# Altium schematic sheet FPGA ram.SchDoc
size A4; Organization: Blinkinlabs, LLC
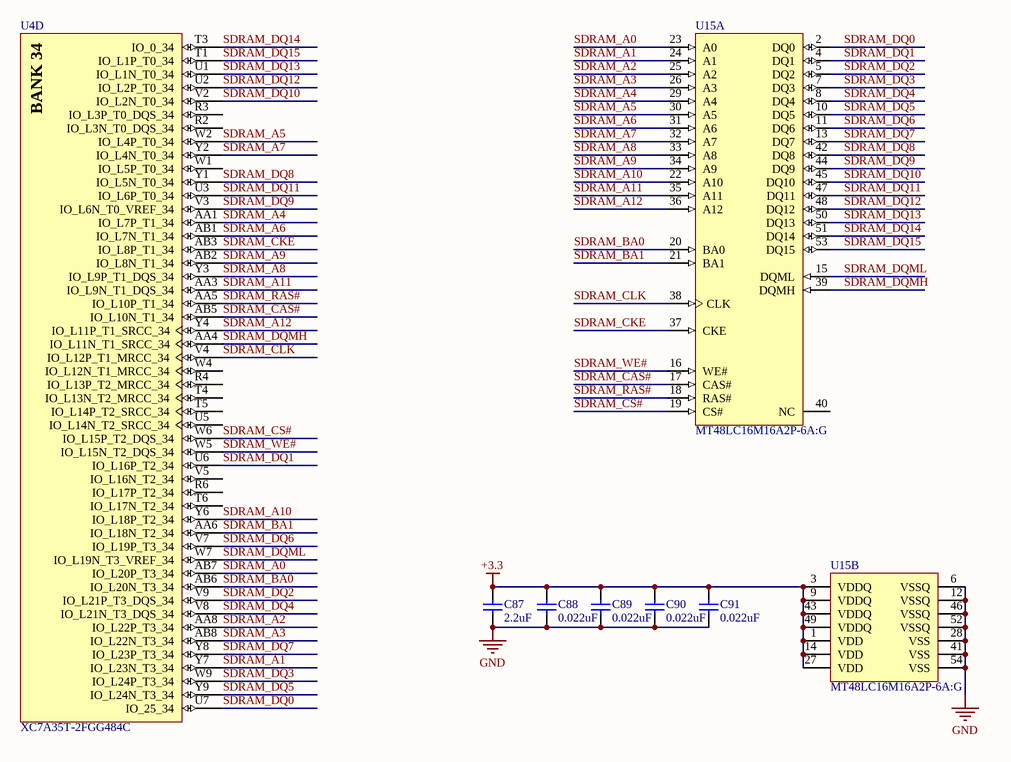
[diagram p0: FPGA ram.SchDoc]

## Parts
C87  2.2uF  [CAPC1005X06L]
C88  0.022uF  [CAPC1005X06L]
C89  0.022uF  [CAPC1005X06L]
C90  0.022uF  [CAPC1005X06L]
C91  0.022uF  [CAPC1005X06L]
U4  XC7A35T-2FGG484C  [FGG484]  (part D of 12)
U15  MT48LC16M16A2P-6A:G  [MICT-TG-54_M]  (parts A,B of 2)

## Nets
+3.3: C87.1 C88.1 C89.1 C90.1 C91.1 U15.1(VDD) U15.3(VDDQ) U15.9(VDDQ) U15.14(VDD) U15.27(VDD) U15.43(VDDQ) U15.49(VDDQ)
GND: C87.2 C88.2 C89.2 C90.2 C91.2 U15.6(VSSQ) U15.12(VSSQ) U15.28(VSS) U15.41(VSS) U15.46(VSSQ) U15.52(VSSQ) U15.54(VSS)
SDRAM_A0: U4.AB7(IO_L20P_T3_34) U15.23(A0)
SDRAM_A1: U4.Y7(IO_L23N_T3_34) U15.24(A1)
SDRAM_A2: U4.AA8(IO_L22P_T3_34) U15.25(A2)
SDRAM_A3: U4.AB8(IO_L22N_T3_34) U15.26(A3)
SDRAM_A4: U4.AA1(IO_L7P_T1_34) U15.29(A4)
SDRAM_A5: U4.W2(IO_L4P_T0_34) U15.30(A5)
SDRAM_A6: U4.AB1(IO_L7N_T1_34) U15.31(A6)
SDRAM_A7: U4.Y2(IO_L4N_T0_34) U15.32(A7)
SDRAM_A8: U4.Y3(IO_L9P_T1_DQS_34) U15.33(A8)
SDRAM_A9: U4.AB2(IO_L8N_T1_34) U15.34(A9)
SDRAM_A10: U4.Y6(IO_L18P_T2_34) U15.22(A10)
SDRAM_A11: U4.AA3(IO_L9N_T1_DQS_34) U15.35(A11)
SDRAM_A12: U4.Y4(IO_L11P_T1_SRCC_34) U15.36(A12)
SDRAM_BA0: U4.AB6(IO_L20N_T3_34) U15.20(BA0)
SDRAM_BA1: U4.AA6(IO_L18N_T2_34) U15.21(BA1)
SDRAM_CAS#: U4.AB5(IO_L10N_T1_34) U15.17(CAS#)
SDRAM_CKE: U4.AB3(IO_L8P_T1_34) U15.37(CKE)
SDRAM_CLK: U4.V4(IO_L12P_T1_MRCC_34) U15.38(CLK)
SDRAM_CS#: U4.W6(IO_L15P_T2_DQS_34) U15.19(CS#)
SDRAM_DQ0: U4.U7(IO_25_34) U15.2(DQ0)
SDRAM_DQ1: U4.U6(IO_L16P_T2_34) U15.4(DQ1)
SDRAM_DQ2: U4.V9(IO_L21P_T3_DQS_34) U15.5(DQ2)
SDRAM_DQ3: U4.W9(IO_L24P_T3_34) U15.7(DQ3)
SDRAM_DQ4: U4.V8(IO_L21N_T3_DQS_34) U15.8(DQ4)
SDRAM_DQ5: U4.Y9(IO_L24N_T3_34) U15.10(DQ5)
SDRAM_DQ6: U4.V7(IO_L19P_T3_34) U15.11(DQ6)
SDRAM_DQ7: U4.Y8(IO_L23P_T3_34) U15.13(DQ7)
SDRAM_DQ8: U4.Y1(IO_L5N_T0_34) U15.42(DQ8)
SDRAM_DQ9: U4.V3(IO_L6N_T0_VREF_34) U15.44(DQ9)
SDRAM_DQ10: U4.V2(IO_L2N_T0_34) U15.45(DQ10)
SDRAM_DQ11: U4.U3(IO_L6P_T0_34) U15.47(DQ11)
SDRAM_DQ12: U4.U2(IO_L2P_T0_34) U15.48(DQ12)
SDRAM_DQ13: U4.U1(IO_L1N_T0_34) U15.50(DQ13)
SDRAM_DQ14: U4.T3(IO_0_34) U15.51(DQ14)
SDRAM_DQ15: U4.T1(IO_L1P_T0_34) U15.53(DQ15)
SDRAM_DQMH: U4.AA4(IO_L11N_T1_SRCC_34) U15.39(DQMH)
SDRAM_DQML: U4.W7(IO_L19N_T3_VREF_34) U15.15(DQML)
SDRAM_RAS#: U4.AA5(IO_L10P_T1_34) U15.18(RAS#)
SDRAM_WE#: U4.W5(IO_L15N_T2_DQS_34) U15.16(WE#)

Not connected (* = marked no-connect by the designer): U4 R2(IO_L3N_T0_DQS_34) R3(IO_L3P_T0_DQS_34) R4(IO_L13P_T2_MRCC_34) R6(IO_L17P_T2_34) T4(IO_L13N_T2_MRCC_34) T5(IO_L14P_T2_SRCC_34) T6(IO_L17N_T2_34) U5(IO_L14N_T2_SRCC_34) V5(IO_L16N_T2_34) W1(IO_L5P_T0_34) W4(IO_L12N_T1_MRCC_34); U15 40(NC)

## Notes on the sheet
- Title:
- Project:
- Revision:
- Date:
- Time:
- Sheet
- of
- (in symbol CMP-0383-00019-1, part D) BANK 34

## Library data of the parts
C87 = GRM155R61A225KE95D: CAP CER 2.2UF 10V X5R 0402; Manufacturer: Murata Electronics North America; Tolerance: ±10%; PartNumber: GRM155R61A225KE95D; Datasheets: http://www.murata.com/~/media/webrenewal/support/library/catalog/products/capacitor/mlcc/c02e.pdf; Image: //media.digikey.com/Renders/Murata%20Renders/ZRB-SERIES-0402.jpg; Digi-Key Part Number: 490-10451-1-ND; Packaging: Cut Tape (CT); Series: GRM; Value: 2.2uF; Voltage: 10V; Temperature Coefficient: X5R; Operating Temperature: -55°C ~ 85°C; Features: Derating Recommended; Applications: General Purpose; Package / Case: 0402 (1005 Metric); Case/Package: 0402
C88-C91 = GRM155R61A223KA01D: CAP CER 0.022UF 10V X5R 0402; Manufacturer: Murata Electronics North America; Tolerance: ±10%; PartNumber: GRM155R61A223KA01D; Datasheets: http://www.murata.com/~/media/webrenewal/support/library/catalog/products/capacitor/mlcc/c02e.pdf; Image: //media.digikey.com/Renders/Murata%20Renders/ZRB-SERIES-0402.jpg; Digi-Key Part Number: 490-6302-1-ND; Packaging: Cut Tape (CT); Series: GRM; Value: 0.022uF; Voltage: 10V; Temperature Coefficient: X5R; Operating Temperature: -55°C ~ 85°C; Features: -; Applications: General Purpose; Package / Case: 0402 (1005 Metric); Case/Package: 0402
U4 = CMP-0383-00019-1: Artix-7 FPGA, 250 User I/Os, 4 GTP, 484-Ball BGA, Speed Grade 2, Commercial Grade, Pb-Free; Manufacturer: Xilinx; Total Block RAM: 1800 Kb; GTP: 4; Available User I/O: 250; Speed Grades: 2; Logic Cells: 33280; CMTs: 5; ComponentLink3URL: http://www.xilinx.com/support/documentation/user_guides/ug475_7Series_Pkg_Pinout.pdf; PackageVersion: Rev. 1.11; ComponentLink2Description: Datasheet; ComponentLink3Description: Pinout; PartNumber: XC7A35T-2FGG484C; DatasheetVersion: Rev. 1.15; Operating Temperature Range: Commercial; PackageDescription: 484-Ball Wire-Bond Fine-Pitch BGA, Body 23 x 23 mm, Pitch 1 mm; ComponentLink4Description: Package Specification; Maximum Distributed RAM: 400 Kb; Mounting Technology: Surface Mount; ComponentLink2URL: http://www.xilinx.com/support/documentation/data_sheets/ds180_7Series_Overview.pdf; ComponentLink1Description: Manufacturer URL; ComponentLink4URL: http://www.xilinx.com/support/documentation/user_guides/ug475_7Series_Pkg_Pinout.pdf; PackageReference: FGG484; ComponentLink1URL: http://www.xilinx.com/
U15 = CMP-2000-05232-1: 256 Mb PC133 SDR SDRAM, 16 Mb x 16, 3 to 3.6 V, 0 to 70 degC, 54-Pin TSOP (TG), Pb-Free; Manufacturer: Micron; Maximum Random Access Time: 6ns; Organisation: 16Mx16bit; Package Version: Rev.W, 05/2012; Minimum Operating Supply Voltage: 3V; Number of Bits per Word: 16bit; Address Bus Width: 15bit; Memory Size: 256MB; Maximum Operating Supply Voltage: 3.6V; Number of Words: 16M; Maximum Operating Temperature: +70degC; Manufacturer URL: https://www.micron.com/; Package URL: https://www.micron.com/~/media/documents/products/data-sheet/dram/256mb_sdr.pdf; Package Type: TSOP; Mounting Type: SurfaceMount; Package Reference: TG-54; Dimensions: 22.22x10.16x1.2mm; Pin Count: 54; Datasheet URL: https://www.micron.com/~/media/documents/products/data-sheet/dram/256mb_sdr.pdf; Height: 1.2mm; Length: 22.22mm; Data Bus Width: 16bit; Datasheet Version: Rev. W, 05/2015; Minimum Operating Temperature: 0degC; Package Description: 54-Pin Thin Small Outline Package, Body 10.2 x 22.3 mm, Pitch 0.8 mm; Width: 10.16mm